# EasyEDA Pro project ProPrj_Motor Driver Board v5.3.7.epro, schematic DRV8874 JST 2P Vertical
Board Name: DRV8874 JST 2P Vertical; Create Date: 2026-01-16; Page Name: P1; Project Name: Motor Driver Board v5; Schematic Name: DRV8874 JST 2P Vertical; Update Date: 2026-01-16; Company: EasyEDA.com; Page Size: A4; Version: V1.0
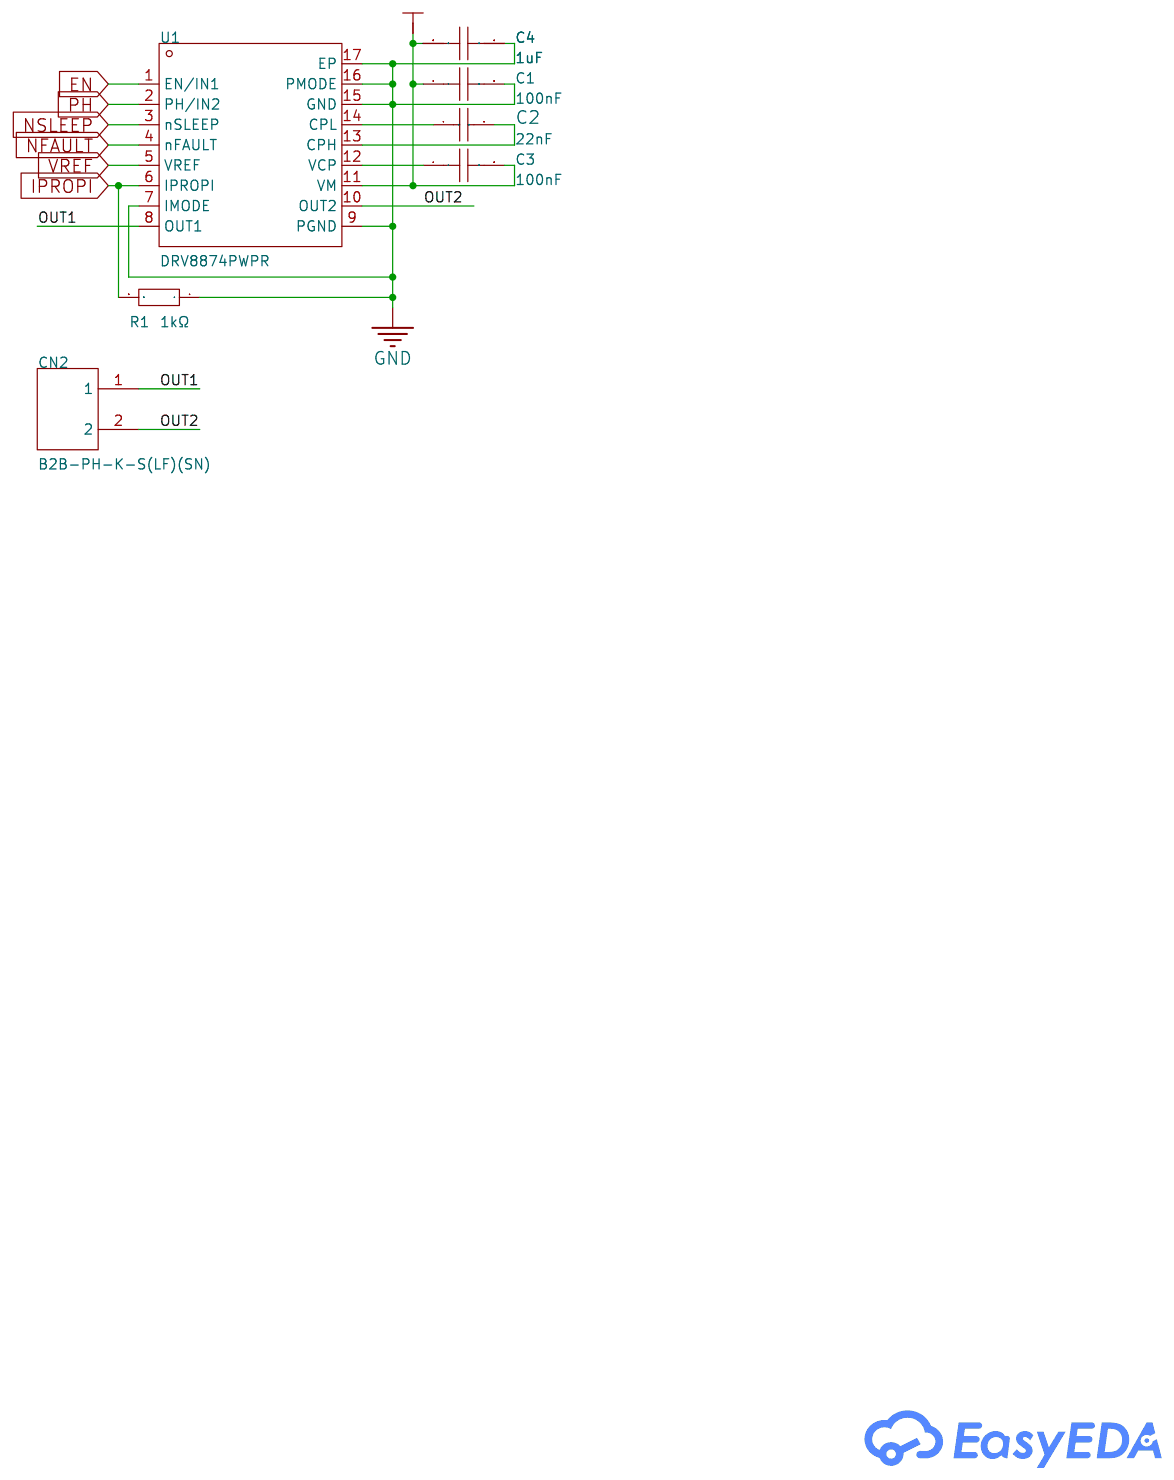
[diagram p0: schematic sheet]

## Parts
C1  100nF  [C0603]
C2  22nF  [C0603]
C3  100nF  [C0603]
C4  1uF  [C0603]
CN2  B2B-PH-K-S(LF)(SN)  [CONN-TH_B2B-PH-K-S]
R1  1kΩ  [R0603]
U1  DRV8874PWPR  [HTSSOP-16_L5.0-W4.4-P0.65-LS6.4-BL-EP]

## Library data of the parts
C1 C3 = CC0603KRX7R9BB104: Capacitance:100nF Tolerance:±10% Tolerance:±10% Voltage Rating:50V Temperature Coefficient:X7R; LCSC Part Name: 100nF ±10% 50V; Supplier Part: C14663; Manufacturer: YAGEO(国巨); Supplier Footprint: 0603; JLCPCB Part Class: Basic Part; Datasheet: https://item.szlcsc.com/datasheet/CC0603KRX7R9BB104/15331.html; Supplier: LCSC; Tolerance: ±10%; Voltage Rating: 50V; Temperature Coefficient: X7R
C2 = CL10B223KB8NNNC: Capacitance:22nF Tolerance:±10% Tolerance:±10% Voltage Rating:50V Temperature Coefficient:X7R; LCSC Part Name: 22nF ±10% 50V; Supplier Part: C21122; Manufacturer: SAMSUNG(三星); Supplier Footprint: 0603; JLCPCB Part Class: Basic Part; Datasheet: https://item.szlcsc.com/datasheet/CL10B223KB8NNNC/21834.html; Supplier: LCSC; Tolerance: ±10%; Voltage Rating: 50V; Temperature Coefficient: X7R
C4 = CL10B105KB8NQNC: Capacitance:1uF Tolerance:±10% Tolerance:±10% Voltage Rating:50V Temperature Coefficient:X7R; LCSC Part Name: 1uF ±10% 50V; Supplier Part: C5199872; Manufacturer: SAMSUNG(三星); Supplier Footprint: 0603; JLCPCB Part Class: Extended Part; Datasheet: https://item.szlcsc.com/datasheet/CL10B105KB8NQNC/5885909.html; Supplier: LCSC; Tolerance: ±10%; Voltage Rating: 50V; Temperature Coefficient: X7R
CN2 = B2B-PH-K-S(LF)(SN): Pins Structure:1x2P Pitch:2mm Mounting Type:Through Hole Reference Series:PH Number of Pins:2P Number of Rows:1 Number of PINs Per Row:2 Row Spacing:- Current Rating:2A Contact Material:Brass Contact Plating:Tin Operating Temperature:-25℃~+85℃ Operating T; LCSC Part Name: 1x2P 间距:2mm 直插 系列:PH; Supplier Part: C131337; Manufacturer: JST; Supplier Footprint: 插件,P=2mm; JLCPCB Part Class: Extended Part; Datasheet: https://item.szlcsc.com/datasheet/B2B-PH-K-S(LF)(SN)/142630.html; Supplier: LCSC; Pins Structure: 1x2P; Pitch: 2mm; Mounting Type: Through Hole; Reference Series: PH; Number of Pins: 2P; Number of Rows: 1; Number of PINs Per Row: 2; Current Rating: 2A; Contact Material: Brass; Contact Plating: Tin; Operating Temperature: -25℃~+85℃; Voltage Rating: 100V; Plastic Material: PA66; Flame Retardant Rating: UL94V-0; Supplementary Features: K Pin; Color: White; Z-Height of the Board: 6mm; X-Length of Bottom Edge on Board (Spacing Line): 5.9mm; Y-Width of Bottom Edge on Board: 4.5mm
R1 = FRC0603F1001TS: Type:Thick Film Resistor Resistance:1kΩ Tolerance:±1% Tolerance:±1% Power(Watts):100mW Voltage-Supply(Max):75V Temperature Coefficient:±100ppm/℃ Temperature Coefficient:±100ppm/℃ Operating Temperature:-55℃~+155℃ Operating Temperature:-55℃~+155℃; LCSC Part Name: 1kΩ ±1% 100mW 厚膜电阻; Supplier Part: C2907002; Manufacturer: FOJAN(富捷); Supplier Footprint: 0603; JLCPCB Part Class: Extended Part; Supplier: LCSC; Type: Thick Film Resistor; Tolerance: ±1%; Power(Watts): 100mW; Voltage-Supply(Max): 75V; Temperature Coefficient: ±100ppm/℃; Operating Temperature: -55℃~+155℃
U1 = DRV8874PWPR: Voltage - Supply:- Voltage - Supply:- Output Current:- Output Current:- RDS(on):200mΩ Peak Current:9A Operating Temperature:-40℃~+125℃ Operating Temperature:-40℃~+125℃; LCSC Part Name: 6A 有刷直流电机驱动芯片 4.5V~37V; Supplier Part: C1855818; Manufacturer: TI(德州仪器); Supplier Footprint: HTSSOP-16-EP; JLCPCB Part Class: Extended Part; Datasheet: https://www.ti.com/cn/lit/gpn/drv8874; Supplier: LCSC; RDS(on): 200mΩ; Peak Current: 9A; Operating Temperature: -40℃~+125℃

## Nets
GND: C1.2 C4.1 R1.1 U1.7(IMODE) U1.9(PGND) U1.15(GND) U1.16(PMODE) U1.17(EP)
VBATT: C1.1 C3.2 C4.2 U1.11(VM)
EN: U1.1(EN/IN1)
IPROPI: R1.2 U1.6(IPROPI)
NFAULT: U1.4(nFAULT)
NSLEEP: U1.3(nSLEEP)
OUT1: CN2.1 U1.8(OUT1)
OUT2: CN2.2 U1.10(OUT2)
PH: U1.2(PH/IN2)
VREF: U1.5(VREF)
$1N607: C2.1 U1.14(CPL)
$1N611: C2.2 U1.13(CPH)
$1N695: C3.1 U1.12(VCP)
